# Altium schematic sheet 1_P1.schdoc
size 431 x 309 mm; Symbol: Sheet-Symbol_A3; Device: Sheet-Symbol_A3; @Page Name: P1; @Create Date: 2022-11-30; @Page Count: 1; @Page No: 1; @Project Name: DripBox; @Schematic Name: wifiPinBoard_1; @Update Date: 2023-02-20; Company: 深圳嘉立创科技发展有限公司; Drawed: 嘉立创EDA; Page Size: A3; Part Number: JLCPCB-001; Reviewed: 嘉立创EDA; Version: V0.1
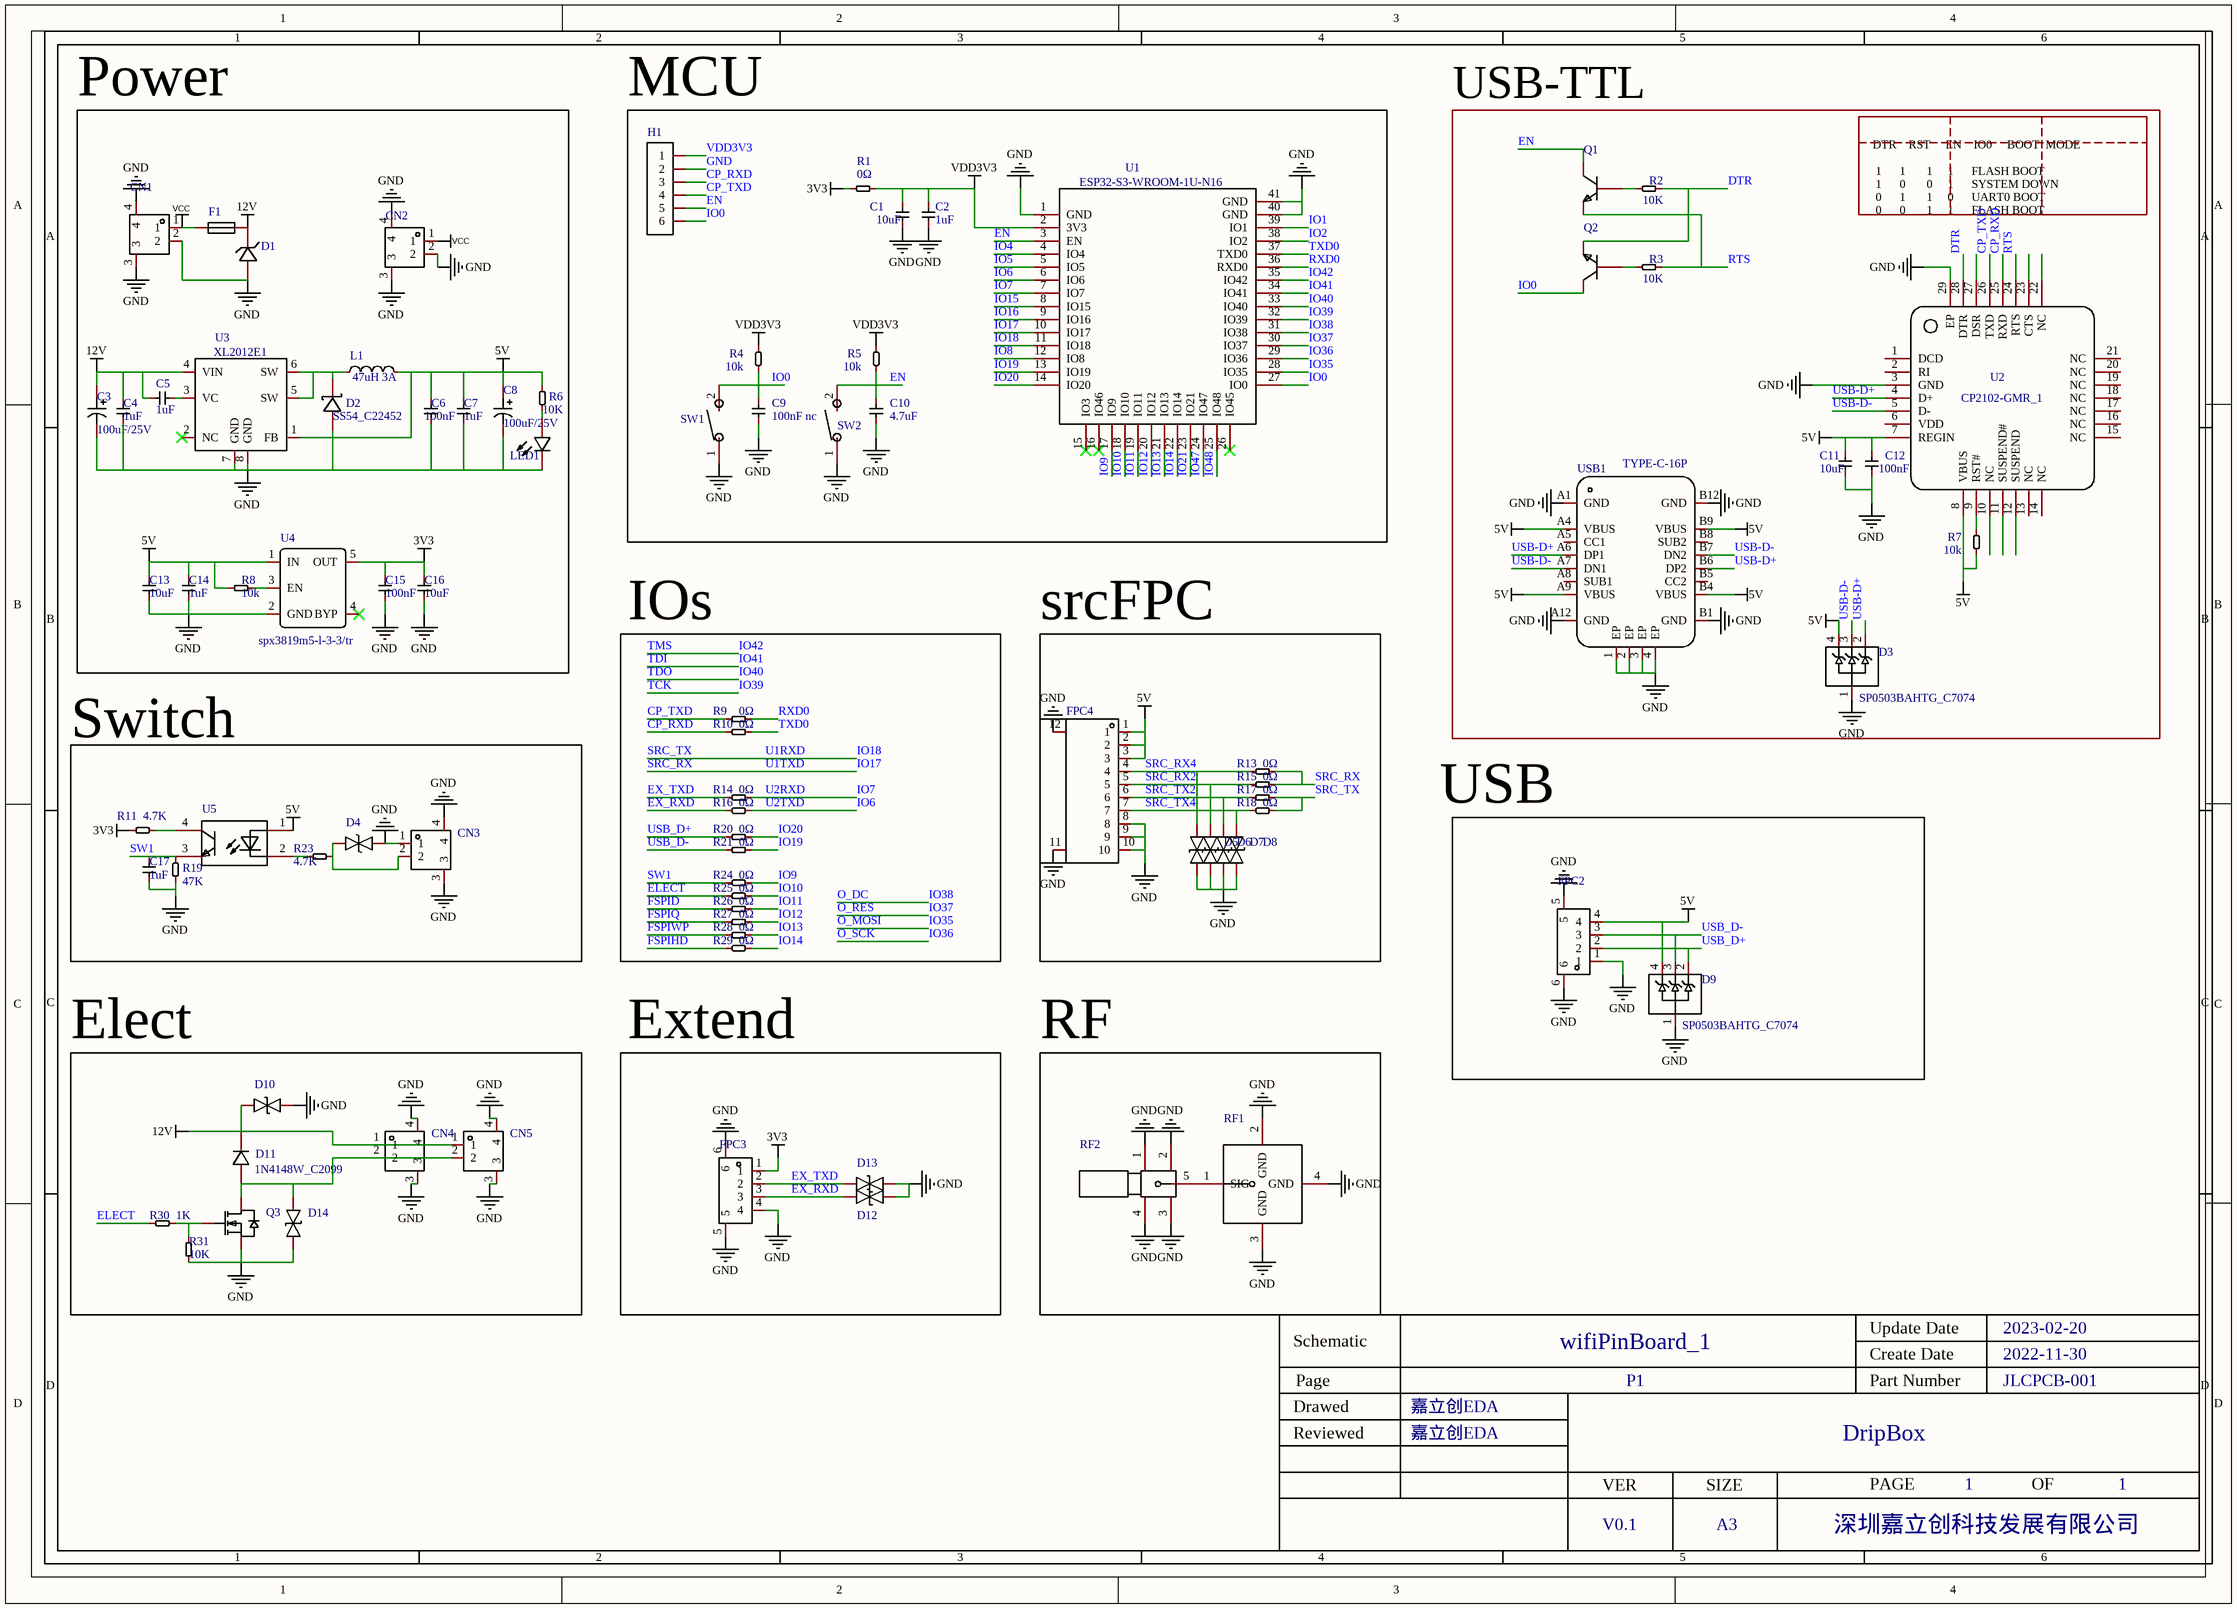
[diagram p0: 1_P1.schdoc]

## Parts
C1  value 10uF  [C0603]  (hidden comment: CAP-0603)
C2  value 1uF  [C0603]  (hidden comment: CAP-0603)
C3  value 100uF/25V  [CAP-SMD_BD6.3-L6.6-W6.6-LS7.6-FD]  (hidden comment: RVT47UF50V67RV0029)
C4  value 1uF  [C0603]  (hidden comment: CAP-0603)
C5  value 1uF  [C0603]  (hidden comment: CAP-0603)
C6  value 100nF  [C0603]  (hidden comment: CAP-0603)
C7  value 1uF  [C0603]  (hidden comment: CAP-0603)
C8  value 100uF/25V  [CAP-SMD_BD6.3-L6.6-W6.6-LS7.6-FD-1]  (hidden comment: RVE100UF35V67RV0072)
C9  value 100nF nc  [C0402]  (hidden comment: CAP-0402)
C10  value 4.7uF  [C0402]  (hidden comment: CAP-0402)
C11  value 10uF  [C0402]  (hidden comment: CAP-0402)
C12  value 100nF  [C0402]  (hidden comment: CAP-0402)
C13  value 10uF  [C0402]  (hidden comment: CAP-0402)
C14  value 1uF  [C0402]  (hidden comment: CAP-0402)
C15  value 100nF  [C0402]  (hidden comment: CAP-0402)
C16  value 10uF  [C0402]  (hidden comment: CAP-0402)
C17  value 1uF  [C0402]  (hidden comment: CAP-0402)
CN1  2.54-2A-LT  [CONN-SMD_2P-P2.54_XH2.54-2AB]  (value not drawn)
CN2  2.54-2A-LT  [CONN-SMD_2P-P2.54_XH2.54-2AB]  (value not drawn)
CN3  2.54-2A-LT  [CONN-SMD_2P-P2.54_XH2.54-2AB]  (value not drawn)
CN4  2.54-2A-LT  [CONN-SMD_2P-P2.54_XH2.54-2AB]  (value not drawn)
CN5  2.54-2A-LT  [CONN-SMD_2P-P2.54_XH2.54-2AB]  (value not drawn)
D1  SMBJ16A_C2848701  [SMB_L4.5-W3.7-LS5.4-RD]  (value not drawn)
D2  SS54_C22452  [SMA_L4.4-W2.8-LS5.4-R-RD]
D3  SP0503BAHTG_C7074  [SOT-143_L2.9-W1.3-P1.92-LS2.3-BR]
D4  SMF6.0CA  [SOD-123_L2.7-W1.8-LS3.7-BI]  (value not drawn)
D5  PESD3V3S1BA-N_C316037  [SOD-523_L1.2-W0.8-LS1.6-BI]  (value not drawn)
D6  PESD3V3S1BA-N_C316037  [SOD-523_L1.2-W0.8-LS1.6-BI]  (value not drawn)
D7  PESD3V3S1BA-N_C316037  [SOD-523_L1.2-W0.8-LS1.6-BI]  (value not drawn)
D8  PESD3V3S1BA-N_C316037  [SOD-523_L1.2-W0.8-LS1.6-BI]  (value not drawn)
D9  SP0503BAHTG_C7074  [SOT-143_L2.9-W1.3-P1.92-LS2.3-BR]
D10  SMF12CA  [SOD-123_L2.8-W1.8-LS3.7-BI]  (value not drawn)
D11  1N4148W  [SOD-123_L2.8-W1.8-LS3.7-RD]  (value not drawn)
D12  PESD3V3S1BA-N_C316037  [SOD-523_L1.2-W0.8-LS1.6-BI]  (value not drawn)
D13  PESD3V3S1BA-N_C316037  [SOD-523_L1.2-W0.8-LS1.6-BI]  (value not drawn)
D14  SMF12CA  [SOD-123_L2.8-W1.8-LS3.7-BI]  (value not drawn)
F1  BSMD1812-200-24V  [F1812]  (value not drawn)
FPC2  XH-4PS  [CONN-SMD_4P-P2.50_DEALON_XH-4PS]  (value not drawn)
FPC3  XH-4PS  [CONN-SMD_4P-P2.50_DEALON_XH-4PS]  (value not drawn)
FPC4  XF3M(1)-1015-1B  [FPC-SMD_10P-P1.00_XF3M1-1015-1B]  (value not drawn)
H1  2.54-1x6P直针  [HDR-TH_6P-P2.54-V-M-1]  (value not drawn)
L1  value 47uH 3A  [IND-SMD_L10.8-W10.0_SLO1040H]  (hidden comment: SLO1040H470MTT)
LED1  NCD0603R1_C84263  [LED0603-RD_RED]  (value not drawn)
Q1  MMST5551_C109331  [SOT-323-3_L2.0-W1.3-P1.30-LS2.1-BR]  (value not drawn)
Q2  MMST5551_C109331  [SOT-323-3_L2.0-W1.3-P1.30-LS2.1-BR]  (value not drawn)
Q3  AO3400A_C20917  [SOT-23-3_L2.9-W1.6-P1.90-LS2.8-BR]  (value not drawn)
R1  value 0Ω  [R0603]  (hidden comment: RES-0603)
R2  value 10K  [R0402_1]  (hidden comment: RES-0402)
R3  value 10K  [R0402_1]  (hidden comment: RES-0402)
R4  value 10k  [R0402_1]  (hidden comment: RES-0402)
R5  value 10k  [R0402_1]  (hidden comment: RES-0402)
R6  value 10K  [R0603]  (hidden comment: RES-0603)
R7  value 10k  [R0402_1]  (hidden comment: RES-0402)
R8  value 10k  [R0402_1]  (hidden comment: RES-0402)
R9  value 0Ω  [R0402_1]  (hidden comment: RES-0402)
R10  value 0Ω  [R0402_1]  (hidden comment: RES-0402)
R11  value 4.7K  [R0402_1]  (hidden comment: RES-0402)
R13  value 0Ω  [R0402_1]  (hidden comment: RES-0402)
R14  value 0Ω  [R0402_1]  (hidden comment: RES-0402)
R15  value 0Ω  [R0402_1]  (hidden comment: RES-0402)
R16  value 0Ω  [R0402_1]  (hidden comment: RES-0402)
R17  value 0Ω  [R0402_1]  (hidden comment: RES-0402)
R18  value 0Ω  [R0402_1]  (hidden comment: RES-0402)
R19  value 47K  [R0402_1]  (hidden comment: RES-0402)
R20  value 0Ω  [R0402_1]  (hidden comment: RES-0402)
R21  value 0Ω  [R0402_1]  (hidden comment: RES-0402)
R23  value 4.7K  [R0402_1]  (hidden comment: RES-0402)
R24  value 0Ω  [R0402_1]  (hidden comment: RES-0402)
R25  value 0Ω  [R0402_1]  (hidden comment: RES-0402)
R26  value 0Ω  [R0402_1]  (hidden comment: RES-0402)
R27  value 0Ω  [R0402_1]  (hidden comment: RES-0402)
R28  value 0Ω  [R0402_1]  (hidden comment: RES-0402)
R29  value 0Ω  [R0402_1]  (hidden comment: RES-0402)
R30  value 1K  [R0402_1]  (hidden comment: RES-0402)
R31  value 10K  [R0402_1]  (hidden comment: RES-0402)
RF1  KH-IPEX-K501-29  [ANT-SMD_KH-IPEX-K501-29]  (value not drawn)
RF2  KH-SMA-KE8-G  [CONN-SMD_KH-SMA-KE8-G]  (value not drawn)
SW1  3*4两脚按键不带柱  [SW-SMD_L4.0-W2.9-LS5.0]  (value not drawn)
SW2  3*4两脚按键不带柱  [SW-SMD_L4.0-W2.9-LS5.0]  (value not drawn)
U1  ESP32-S3-WROOM-1U-N16  [WIRELM-SMD_ESP32-S3-WROOM-1U]
U2  CP2102-GMR_1  [QFN-28_L5.0-W5.0-P0.50-BL-EP_1]
U3  XL2012E1  [SOIC-8_L5.0-W4.0-P1.27-LS6.0-BL]
U4  spx3819m5-l-3-3/tr  [SOT-23-5_L3.0-W1.7-P0.95-LS2.8-BR]
U5  EL3H7(B)(TA)-G  [SOP-4_L4.4-W2.8-P1.27-LS7.0-TL]  (value not drawn)
USB1  TYPE-C-16P  [USB-C-SMD_KH-TYPE-C-16P]

## Blocks framed on the sheet
Power: C3-C8 C13-C16 CN1 CN2 D1 D2 F1 L1 LED1 R6 R8 U3 U4
MCU: C1 C2 C9 C10 H1 R1 R4 R5 SW1 SW2 U1
USB-TTL: C11 C12 D3 Q1 Q2 R2 R3 R7 U2 USB1
IOs: R9 R10 R14 R16 R20 R21 R24-R29
srcFPC: D5-D8 FPC4 R13 R15 R17 R18
Switch: C17 CN3 D4 R11 R19 R23 U5
Elect: CN4 CN5 D10 D11 D14 Q3 R30 R31
Extend: D12 D13 FPC3
RF: RF1 RF2

## Nets
3V3: C15.1 C16.1 FPC3.1 R1.1 R11.1 U4.5(OUT)
5V: C6.1 C7.1 C8.1 C11.1 C12.1 C13.1 C14.1 D3.4 D9.4 FPC2.4 FPC4.1 FPC4.2 FPC4.3 L1.2 R6.1 R7.1 R8.2 U2.7(REGIN) U2.8(VBUS) U3.1(FB) U4.1(IN) U5.1(AN) USB1.A4(VBUS) USB1.A9(VBUS) USB1.B4(VBUS) USB1.B9(VBUS)
12V: C3.1 C4.1 C5.1 CN4.1 CN5.1 D1.1(C) D10.2(A) D11.1(K) F1.2 U3.4(VIN)
GND: C1.2 C2.2 C3.2 C4.2 C6.2 C7.2 C8.2 C9.2 C10.2 C11.2 C12.2 C13.2 C14.2 C15.2 C16.2 C17.2 CN1.2 CN1.3 CN1.4 CN2.2 CN2.3 CN2.4 CN3.1 CN3.3 CN3.4 CN4.3 CN4.4 CN5.3 CN5.4 D1.2(A) D2.1(A) D3.1 D4.1 D5.1 D6.1 D7.1 D8.1 D9.1 D10.1(K) D12.1 D13.1 D14.1(K) FPC2.1 FPC2.5 FPC2.6 FPC3.4 FPC3.5 FPC3.6 FPC4.8 FPC4.9 FPC4.10 FPC4.11 FPC4.12 H1.2 LED1.1(K) Q3.2(S) R19.2 R31.1 RF1.2(GND) RF1.3(GND) RF1.4(GND) RF2.1 RF2.2 RF2.3 RF2.4 SW1.1 SW2.1 U1.1(GND) U1.40(GND) U1.41(GND) U2.3(GND) U2.29(EP) U3.7(GND) U3.8(GND) U4.2(GND) USB1.1(EP) USB1.2(EP) USB1.3(EP) USB1.4(EP) USB1.A1(GND) USB1.A12(GND) USB1.B1(GND) USB1.B12(GND)
VCC: CN1.1 CN2.1 F1.1
VDD3V3: C1.1 C2.1 H1.1 R1.2 R4.2 R5.2 U1.2(3V3)
CP_RXD: H1.3 R10.1 U2.25(RXD)
CP_TXD: H1.4 R9.1 U2.26(TXD)
DTR: Q2.2(E) R2.2 U2.28(DTR)
ELECT: R25.1 R30.1
EN: C10.1 H1.5 Q1.3(C) R5.1 SW2.2 U1.3(EN)
EX_RXD: D12.2 FPC3.3 R16.1
EX_TXD: D13.2 FPC3.2 R14.1
FSPID: R26.1
FSPIHD: R29.1
FSPIQ: R27.1
FSPIWP: R28.1
IO0: C9.1 H1.6 Q2.3(C) R4.1 SW1.2 U1.27(IO0)
IO1: U1.39(IO1)
IO2: U1.38(IO2)
IO4: U1.4(IO4)
IO5: U1.5(IO5)
IO6: R16.2 U1.6(IO6)  [also labelled U2TXD]
IO7: R14.2 U1.7(IO7)  [also labelled U2RXD]
IO8: U1.12(IO8)
IO9: R24.2 U1.17(IO9)
IO10: R25.2 U1.18(IO10)
IO11: R26.2 U1.19(IO11)
IO12: R27.2 U1.20(IO12)
IO13: R28.2 U1.21(IO13)
IO14: R29.2 U1.22(IO14)
IO15: U1.8(IO15)
IO16: U1.9(IO16)
IO17: R13.2 R15.2 U1.10(IO17)  [also labelled SRC_RX, U1TXD]
IO18: R17.2 R18.2 U1.11(IO18)  [also labelled SRC_TX, U1RXD]
IO19: R21.2 U1.13(IO19)
IO20: R20.2 U1.14(IO20)
IO21: U1.23(IO21)
IO35: U1.28(IO35)  [also labelled O_MOSI]
IO36: U1.29(IO36)  [also labelled O_SCK]
IO37: U1.30(IO37)  [also labelled O_RES]
IO38: U1.31(IO38)  [also labelled O_DC]
IO39: U1.32(IO39)  [also labelled TCK]
IO40: U1.33(IO40)  [also labelled TDO]
IO41: U1.34(IO41)  [also labelled TDI]
IO42: U1.35(IO42)  [also labelled TMS]
IO47: U1.24(IO47)
IO48: U1.25(IO48)
RTS: Q1.2(E) R3.2 U2.24(RTS)
RXD0: R9.2 U1.36(RXD0)
SRC_RX2: D6.2 FPC4.5 R15.1
SRC_RX4: D5.2 FPC4.4 R13.1
SRC_TX2: D7.2 FPC4.6 R17.1
SRC_TX4: D8.2 FPC4.7 R18.1
SW1: C17.1 R19.1 R24.1 U5.3(EM)
TXD0: R10.2 U1.37(TXD0)
USB-D+: D3.2 U2.4(D+) USB1.A6(DP1) USB1.B6(DP2)
USB-D-: D3.3 U2.5(D-) USB1.A7(DN1) USB1.B7(DN2)
USB_D+: D9.2 FPC2.2 R20.1
USB_D-: D9.3 FPC2.3 R21.1
NetC5_2: C5.2 U3.3(VC)
NetCN3_2: CN3.2 D4.2 R23.1
NetCN4_2: CN4.2 CN5.2 D11.2(A) D14.2(A) Q3.3(D)
NetD2_2: D2.2(K) L1.1 U3.5(SW) U3.6(SW)
NetLED1_2: LED1.2(A) R6.2
NetQ1_1: Q1.1(B) R2.1
NetQ2_1: Q2.1(B) R3.1
NetQ3_1: Q3.1(G) R30.2 R31.2
NetR7_2: R7.2 U2.9(RST#)
NetR8_1: R8.1 U4.3(EN)
NetR11_2: R11.2 U5.4(COL)
NetR23_2: R23.2 U5.2(CAT)
NetRF1_1: RF1.1(SIG) RF2.5

Not connected (* = marked no-connect by the designer): U1 15(IO3)* 16(IO46)* 26(IO45)*; U2 1(DCD) 2(RI) 6(VDD) 10(NC) 11(SUSPEND#) 12(SUSPEND) 13(NC) 14(NC) 15(NC) 16(NC) 17(NC) 18(NC) 19(NC) 20(NC) 21(NC) 22(NC) 23(CTS) 27(DSR); U3 2(NC)*; U4 4(BYP)*; USB1 A5(CC1) A8(SUB1) B5(CC2) B8(SUB2)

## Notes on the sheet
- (near U2) DTR    RST     EN    IO0     BOOT  MODE
  1      1       1     1      FLASH BOOT
  1      0       0     1      SYSTEM DOWN
  0      1       1     0      UART0 BOOT
  0      0       1     1      FLASH BOOT
- USB
- 1
- 2
- 3
- 4
- 5
- 6
- A
- B
- C
- Schematic
- wifiPinBoard_1
- Create Date
- Update Date
- 2022-11-30
- 2023-02-20
- D
- Reviewed
- Drawed
- Page
- 嘉立创EDA
- P1
- Part Number
- DripBox
- JLCPCB-001
- VER
- SIZE
- PAGE
- OF
- V0.1
- A3
- 深圳嘉立创科技发展有限公司

## Library data of the parts
C1 C2 C4-C7 = CAP-0603: 容值:1uF;精度:±10%;额定电压:50V;温度系数:X5R;; Manufacturer: SAMSUNG(三星); Manufacturer Part: CL10A105KB8NNNC; Add into BOM: yes; Tolerance: ±10%; Voltage Rated: 50V; Temperature Coefficient: X5R; Symbol: CAP-0402; Device: CAP-0603; LCSC Part Name: 1uF ±10% 50V; Supplier Part: C15849; Supplier Footprint: 0603; JLCPCB Part Class: Basic Part; Datasheet: https://atta.szlcsc.com/upload/public/pdf/source/20160103/1457707679084.pdf; Supplier: LCSC; Convert to PCB: yes
C3 = RVT47UF50V67RV0029: 容值:47uF;额定电压:50V;工作寿命:2000hrs@105;; Manufacturer: KNSCHA(科尼盛); Add into BOM: yes; Rated Voltage: 50V; Name: 100uF/25V; Symbol: RVT47UF50V67RV0029; Device: RVT47UF50V67RV0029; LCSC Part Name: 47uF 50V; Supplier Part: C2887275; Manufacturer Part: RVT47UF50V67RV0029; Supplier Footprint: SMD,D6.3xL7.7mm; JLCPCB Part Class: 扩展库; Datasheet: https://atta.szlcsc.com/upload/public/pdf/source/20210824/3B61B08E802BEB202F31F6CC5BD6B8B5.pdf; Supplier: LCSC; Convert to PCB: yes; Lifetime @ Temp: 2000hrs@105
C8 = RVE100UF35V67RV0072: 容值:100uF;额定电压:35V;电容体直径:-;电容体长度:-;纹波电流:-;等效串联电阻:-;工作寿命:-;; Manufacturer: KNSCHA(科尼盛); Add into BOM: yes; Rated Voltage: 35V; Name: 100uF/25V; Symbol: RVE100UF35V67RV0072; Device: RVE100UF35V67RV0072; LCSC Part Name: 100uF 35V; Supplier Part: C2836437; Manufacturer Part: RVE100UF35V67RV0072; Supplier Footprint: SMD,D6.3xL7.7mm; JLCPCB Part Class: 扩展库; Datasheet: https://atta.szlcsc.com/upload/public/pdf/source/20220719/B52EB46F8A1558448ED03D8B4CB3C24F.pdf; Supplier: LCSC; Convert to PCB: yes; φD: -; L: -; Ripple Current: -; Equivalent Series Resistance(ESR): -; Lifetime @ Temp: -
C9-C17 = CAP-0402: 容值:1uF;精度:±10%;额定电压:10V;温度系数:X5R;; Manufacturer: SAMSUNG(三星); Manufacturer Part: CL05A105KP5NNND; Add into BOM: yes; Tolerance: ±10%; Voltage Rated: 10V; Temperature Coefficient: X5R; Symbol: CAP-0402; Device: CAP-0402; LCSC Part Name: 1uF ±10% 10V; Supplier Part: C307414; Supplier Footprint: 0402; JLCPCB Part Class: Extended Part; Datasheet: https://atta.szlcsc.com/upload/public/pdf/source/20181009/C307414_0A02B57115E94FED95F0CB1E32115BFC.pdf; Supplier: LCSC; Convert to PCB: yes
CN1-CN5 = 2.54-2A-LT: 参考系列:XH;间距:2.54mm;插针结构:1x2P;排数:1;每排PIN数:2;行距:-;公母:公型插针;安装方式:立贴;额定电流:500mA;工作温度范围:-25℃~+85℃;; Manufacturer: CAX(创都); Add into BOM: yes; Reference Series: XH; Pitch: 2.54mm; Pins Structure: 1x2P; Number of PINs Per Row: 2; Gender: 公型插针; Current Rating (Max): 500mA; Name: 2.54-2A-LT; Symbol: 2.54-2A-LT; Device: 2.54-2A-LT; LCSC Part Name: 2.54-2A-LT; Supplier Part: C722695; Manufacturer Part: 2.54-2A-LT; Supplier Footprint: SMD,P=2.54mm; JLCPCB Part Class: 扩展库; Datasheet: https://atta.szlcsc.com/upload/public/pdf/source/20200903/C722694_5A7103419A51CDA6451A9029F9B5B2B1.pdf; Supplier: LCSC; Convert to PCB: yes; Number of Rows: 1; Row Spacing: -; Mounting Style: 立贴; Operating Temperature Range: -25℃~+85℃
D1 = SMBJ16A_C2848701: 极性:单向;反向截止电压(Vrwm):16V;击穿电压(最小值):17.8V;击穿电压(最大值):20.5V;反向漏电流(Ir):5A;峰值脉冲电流(Ipp)@10/1000s:23.1A;最大钳位电压:26V;峰值脉冲功率(Ppp)@10/1000s:-;; Manufacturer: GOODWORK(固得沃克); Add into BOM: yes; Polarity: 单向; Reverse Stand-Off Voltage (Vrwm): 16V; Breakdown Voltage (Min): 17.8V; Breakdown Voltage (Max): 20.5V; Reverse Leakage Current (Ir): 5A; Peak Pulse Current (Ipp)@10/1000μs: 23.1A; Maximum Clamping Voltage: 26V; Name: SMBJ16A; Symbol: SMBJ16A_C2848701; Device: SMBJ16A_C2848701; LCSC Part Name: 单向 16V; Supplier Part: C2848701; Manufacturer Part: SMBJ16A; Supplier Footprint: SMB(DO-214AA); JLCPCB Part Class: 扩展库; Datasheet: https://atta.szlcsc.com/upload/public/pdf/source/20201231/C908783_5F0AE07776753216FC0A4122EEBBB8E2.pdf; Supplier: LCSC; Convert to PCB: yes; Peak Pulse Power Dissipation (Ppp)@10/1000μs: -
D2 = SS54_C22452: 直流反向耐压(Vr):40V;平均整流电流(Io):5A;正向压降(Vf):550mV@5A;; Manufacturer: MDD; Name: SS54; Add into BOM: yes; Reverse Voltage (Vr): 40V; Average Rectified Current (Io): 5A; Symbol: SS54_C22452; Device: SS54_C22452; LCSC Part Name: 40V 5A 550mV@5A; Supplier Part: C22452; Manufacturer Part: SS54; Supplier Footprint: SMA(DO-214AC); JLCPCB Part Class: 基础库; Datasheet: https://atta.szlcsc.com/upload/public/pdf/source/20190306/C22452_DC5E4F74C3B638F6D8E4C7650D5BF30E.pdf; Supplier: LCSC; Convert to PCB: yes; Forward Voltage (Vf@If): 550mV@5A
D3 D9 = SP0503BAHTG_C7074: Manufacturer: Littelfuse(美国力特); Add into BOM: yes; Name: SP0503BAHTG; Symbol: SP0503BAHTG; Device: SP0503BAHTG_C7074; LCSC Part Name: SP0503BAHTG; Supplier Part: C7074; Manufacturer Part: SP0503BAHTG; Supplier Footprint: SOT-143; JLCPCB Part Class: 扩展库; Datasheet: https://atta.szlcsc.com/upload/public/pdf/source/20160723/1469258976518.pdf; Supplier: LCSC; Convert to PCB: yes
D4 = SMF6.0CA_C435459: 极性:双向;反向截止电压(Vrwm):6V;击穿电压:6.67V;峰值脉冲电流(Ipp)@10/1000s:19.4A;最大钳位电压:10.3V;; Manufacturer: AnBon(安邦); Add into BOM: yes; Polarity: 双向; Reverse Stand-Off Voltage (Vrwm): 6V; Breakdown Voltage: 6.67V; Peak Pulse Current (Ipp)@10/1000μs: 19.4A; Maximum Clamping Voltage: 10.3V; Name: SMF6.0CA; Symbol: SMF6.0CA_C435459; Device: SMF6.0CA_C435459; LCSC Part Name: 双向 Vrwm:6V; Supplier Part: C435459; Manufacturer Part: SMF6.0CA; Supplier Footprint: SOD-123; JLCPCB Part Class: 扩展库; Datasheet: https://atta.szlcsc.com/upload/public/pdf/source/20191009/C435459_5796EF5BCA7523EFA6A562081B6F4DC8.pdf; Supplier: LCSC; Convert to PCB: yes
D5-D8 D12 D13 = PESD3V3S1BA-N_C316037: 极性:双向;反向截止电压(Vrwm):3.3V@Max;击穿电压(最小值):4V;峰值脉冲电流(Ipp)@10/1000s:10A@8/20s;最大钳位电压:10V;; Manufacturer: BORN(伯恩半导体); Add into BOM: yes; Polarity: 双向; Breakdown Voltage (Min): 4V; Maximum Clamping Voltage: 10V; Name: PESD3V3S1BA-N; Symbol: PESD3V3S1BA-N; Device: PESD3V3S1BA-N_C316037; LCSC Part Name: 双向 Vrwm:3.3V@Max; Supplier Part: C316037; Manufacturer Part: PESD3V3S1BA-N; Supplier Footprint: SOD-523; JLCPCB Part Class: 扩展库; Datasheet: https://atta.szlcsc.com/upload/public/pdf/source/20181025/C316037_BAF19C01D27FCD10CB9CD774B67153C5.pdf; Supplier: LCSC; Convert to PCB: yes; Reverse Stand-Off Voltage (Vrwm): 3.3V@Max; Peak Pulse Current (Ipp)@10/1000μs: 10A@8/20s
D10 D14 = SMF12CA_C284110: 极性:双向;反向截止电压(Vrwm):12V;击穿电压:13.3V;峰值脉冲电流(Ipp)@10/1000s:10.05A;最大钳位电压:19.9V;; Manufacturer: DOWO(东沃); Add into BOM: yes; Polarity: 双向; Reverse Stand-Off Voltage (Vrwm): 12V; Breakdown Voltage: 13.3V; Peak Pulse Current (Ipp)@10/1000μs: 10.05A; Maximum Clamping Voltage: 19.9V; Name: SMF12CA; Symbol: SMF12CA; Device: SMF12CA_C284110; LCSC Part Name: 双向 Vrwm:12V; Supplier Part: C284110; Manufacturer Part: SMF12CA; Supplier Footprint: SOD-123; JLCPCB Part Class: 扩展库; Datasheet: https://atta.szlcsc.com/upload/public/pdf/source/20180913/C284110_147BE089EFF8300E026DAF83CCD817E7.pdf; Supplier: LCSC; Convert to PCB: yes
D11 = 1N4148W_C2099: 二极管配置:独立式;功率:500mW;直流反向耐压(Vr):100V;平均整流电流(Io):150mA;正向压降(Vf):1.25V@150mA;反向电流(Ir):1uA@75V;反向恢复时间(trr):4ns;工作温度:+150℃@(Tj);; Manufacturer: CJ(江苏长电/长晶); Symbol: 1N4148W T4; Add into BOM: yes; Diode Configuration: 独立式; Power Dissipation: 500mW; Reverse Voltage (Vr): 100V; Average Rectified Current (Io): 150mA; Reverse Recovery Time (trr): 4ns; Name: 1N4148W; Device: 1N4148W_C2099; LCSC Part Name: 100V 150mA 4ns T4; Supplier Part: C2099; Manufacturer Part: 1N4148W; Supplier Footprint: SOD-123; JLCPCB Part Class: 扩展库; Datasheet: https://atta.szlcsc.com/upload/public/pdf/source/20120428/1457706480199.pdf; Supplier: LCSC; Convert to PCB: yes; Forward Voltage (Vf@If): 1.25V@150mA; Reverse Leakage Current: 1uA@75V; Operating Temperature: +150℃@(Tj)
F1 = BSMD1812-200-24V: 最大电压:24V;最大电流:40A;保持电流:2A;跳闸电流:4A;消耗功率:800mW;初始态阻值(最小值):20mΩ;跳断后阻值(最大值):100mΩ;最大动作时间:2s;工作温度:-40~+85;; Manufacturer: BHFUSE(佰宏); Add into BOM: yes; Operating Voltage (Max): 24V; Current Rating (Max): 40A; Hold Current: 2A; Trip Current: 4A; Power Dissipation: 800mW; Resistance - Initial (Ri) (Min): 20mΩ; Resistance - Post Trip (R1) (Max): 100mΩ; Maximum Time to Trip: 2s; Name: BSMD1812-200-24V; Symbol: BSMD1812-200-24V; Device: BSMD1812-200-24V; LCSC Part Name: 1812 2A 24V 佰宏高电压; Supplier Part: C883157; Manufacturer Part: BSMD1812-200-24V; Supplier Footprint: 1812; JLCPCB Part Class: 扩展库; Datasheet: https://atta.szlcsc.com/upload/public/pdf/source/20220302/C2BC3E2021B64191B0EAEFE91C1E6D76.pdf; Supplier: LCSC; Convert to PCB: yes; Operating Temperature: -40~+85
FPC2 FPC3 = XH-4PS: 参考系列:XH;间距:2.5mm;插针结构:1x4P;排数:1;每排PIN数:4;行距:-;公母:公型插针;安装方式:立贴;额定电流:3A;工作温度范围:-25℃~+85℃;; Manufacturer: DEALON(德艺隆); Add into BOM: yes; Reference Series: XH; Pitch: 2.5mm; Pins Structure: 1x4P; Number of PINs Per Row: 4; Gender: 公型插针; Current Rating (Max): 3A; Name: XH-4PS; Symbol: XH-4PS; Device: XH-4PS; LCSC Part Name: XH 2.5mm 1x4P 立贴; Supplier Part: C2904981; Manufacturer Part: XH-4PS; Supplier Footprint: SMD,P=2.5mm; JLCPCB Part Class: 扩展库; Datasheet: https://atta.szlcsc.com/upload/public/pdf/source/20211025/7FE20CBFE69B14B158D03C81143E3D85.pdf; Supplier: LCSC; Convert to PCB: yes; Number of Rows: 1; Row Spacing: -; Mounting Style: 立贴; Operating Temperature Range: -25℃~+85℃
FPC4 = XF3M(1)-1015-1B: 间距:1mm;触点数量:10;锁定特性:-;安装类型:卧贴;触点类型:双侧触点/上下接;; Manufacturer: OMRON(欧姆龙); Add into BOM: yes; Pitch: 1mm; Number of Contacts: 10; FFC, FCB Thickness: 0.3mm; Name: XF3M(1)-1015-1B; Symbol: XF3M(1)-1015-1B; Device: XF3M(1)-1015-1B; LCSC Part Name: 1mm P数:10 双侧触点/上下接; Supplier Part: C231427; Manufacturer Part: XF3M(1)-1015-1B; Supplier Footprint: SMD,P=1mm; JLCPCB Part Class: 扩展库; Datasheet: https://atta.szlcsc.com/upload/public/pdf/source/20180910/C231427_B13922BAFD8608886BCAD203DC0D40D0.pdf; Supplier: LCSC; Convert to PCB: yes; Locking Feature: -; Mounting Type: 卧贴; Contact Type: 双侧触点/上下接; Height Above Board: 2mm
H1 = 2.54-1x6P直针: 排数:单排;总PIN位数:6;间距:2.54mm;插针结构:1x6P;行距:-;安装类型:直插;圆针/方针:方针;额定电流:3A;额定电压:-;配合针长度:-;塑高:-;触头材质:黄铜;触头镀层:-;工作温度范围:-40℃~+105℃;颜色:黑色;; Manufacturer: BOOMELE(博穆精密); Symbol: Header-Male-2.54_1x6; Add into BOM: yes; Pitch: 2.54mm; Pin Structure: 1x6P; Circluar Pins/Square Pins: 方针; Current Rating (Max): 3A; Name: 2.54-1x6P直针; Device: 2.54-1x6P直针; LCSC Part Name: 2.54mm 1x6P 直插 方针; Supplier Part: C37208; Manufacturer Part: 2.54-1x6P直针; Supplier Footprint: 直插,P=2.54mm; JLCPCB Part Class: 扩展库; Datasheet: https://atta.szlcsc.com/upload/public/pdf/source/20151109/1457707558014.pdf; Supplier: LCSC; Convert to PCB: yes; Number of Rows: 单排; Number of Pins: 6; Row Spacing: -; Mounting Type: 直插; Voltage Rating (Max): -; Length of Mating Pin: -; Insulation Height: -; Contact Material: 黄铜; Contact Plating: -; Operating Temperature Range: -40℃~+105℃; Color: 黑色
L1 = SLO1040H470MTT: 电感值:47uH;精度:±20%;额定电流:3A;直流电阻(DCR):145mΩ;; Manufacturer: Sunltech(韩国顺磁); Add into BOM: yes; Tolerance: ±20%; Rated Current: 3A; DC Resistance (DCR): 145mΩ; Name: 47uH 3A; Symbol: SLO1040H470MTT; Device: SLO1040H470MTT; LCSC Part Name: 47uH ±20% 3A 145mΩ; Supplier Part: C182153; Manufacturer Part: SLO1040H470MTT; Supplier Footprint: SMD; JLCPCB Part Class: 扩展库; Datasheet: https://atta.szlcsc.com/upload/public/pdf/source/20201009/C207854_ACA4210DD273ACBB198904FC5A3A8806.pdf; Supplier: LCSC; Convert to PCB: yes
LED1 = NCD0603R1_C84263: 发光颜色:红灯;; Manufacturer: 国星光电; Symbol: FC-DA1608HRK-620D; Add into BOM: yes; Emitted Color: 红灯; Name: NCD0603R1; Device: NCD0603R1_C84263; LCSC Part Name: 红灯; Supplier Part: C84263; Manufacturer Part: NCD0603R1; Supplier Footprint: 0603; JLCPCB Part Class: 扩展库; Datasheet: https://atta.szlcsc.com/upload/public/pdf/source/20200820/C84263_DABC6A75E58F576973B407FDBA283D60.pdf; Supplier: LCSC; Convert to PCB: yes
Q1 Q2 = MMST5551_C109331: 晶体管类型:NPN;集射极击穿电压(Vceo):160V;集电极电流(Ic):600mA;功率(Pd):200mW;集电极截止电流(Icbo):50nA;集电极-发射极饱和电压(VCE(sat)@Ic,Ib):200mV@50mA,5mA;直流电流增益(hFE@Ic,Vce):100@10mA,5V;特征频率(fT):100MHz;工作温度:+150@(Tj);; Manufacturer: CJ(江苏长电/长晶); Add into BOM: yes; Transistor Type: NPN; Collector-Emitter Breakdown Voltage (Vceo): 160V; Collector Current (Ic): 600mA; Power Dissipation (Pd): 200mW; Collector Cut-Off Current (Icbo): 50nA; Transition Frequency (fT): 100MHz; Name: MMST5551; Symbol: MMST5551; Device: MMST5551_C109331; LCSC Part Name: MMST5551 100~300 100~300; Supplier Part: C109331; Manufacturer Part: MMST5551; Supplier Footprint: SOT-323(SC-70); JLCPCB Part Class: 扩展库; Datasheet: https://atta.szlcsc.com/upload/public/pdf/source/20170428/1493376776532.pdf; Supplier: LCSC; Convert to PCB: yes; Collector-Emitter Saturation Voltage (VCE(sat)@Ic,Ib): 200mV@50mA,5mA; DC Current Gain (hFE@Ic,Vce): 100@10mA,5V; Operating Temperature: +150@(Tj)
Q3 = AO3400A_C20917: 类型:N沟道;漏源电压(Vdss):30V;连续漏极电流(Id):5.7A;功率(Pd):1.4W;导通电阻(RDS(on)@Vgs,Id):26.5mΩ@10V,5.7A;阈值电压(Vgs(th)@Id):1.5V@250uA;; Manufacturer: AOS; Add into BOM: yes; Type: N沟道; Drain Source Voltage (Vdss): 30V; Power Dissipation (Pd): 1.4W; Name: AO3400A; Symbol: AO3400A; Device: AO3400A_C20917; LCSC Part Name: N沟道 30V 5.7A; Supplier Part: C20917; Manufacturer Part: AO3400A; Supplier Footprint: SOT-23-3L; JLCPCB Part Class: 基础库; Datasheet: https://atta.szlcsc.com/upload/public/pdf/source/20140107/1457706668533.pdf; Supplier: LCSC; Convert to PCB: yes; Continuous Drain Current (Id): 5.7A; Drain Source On Resistance (RDS(on)@Vgs,Id): 26.5mΩ@10V,5.7A; Gate Threshold Voltage (Vgs(th)@Id): 1.5V@250uA
R1 R6 = RES-0603: 电阻类型:厚膜电阻;阻值:1kΩ;精度:±1%;功率:1/10W;温度系数:±100ppm/;最大工作电压:75V;工作温度范围:-55~+155;; Manufacturer: UNI-ROYAL(厚声); Manufacturer Part: 0603WAF1001T5E; Add into BOM: yes; Tolerance: ±1%; Power(Watts): 1/10W; Overload Voltage (Max): 75V; Symbol: RES-0402; Device: RES-0603; LCSC Part Name: 1kΩ ±1%; Supplier Part: C21190; Supplier Footprint: 0603; JLCPCB Part Class: Basic Part; Datasheet: https://atta.szlcsc.com/upload/public/pdf/source/20200306/C422600_1E6D84923E4A46A82E41ADD87F860B5C.pdf; Supplier: LCSC; Convert to PCB: yes; Type: 厚膜电阻; Temperature Coefficient: ±100ppm/; Operating Temperature Range: -55~+155
R2-R5 R7 R8 R11 R19 R23 = RES-0402: 电阻类型:厚膜电阻;阻值:1k;精度:±1%;功率:1/16W;温度系数:±100ppm/;最大工作电压:50V;工作温度范围:-55~+155;; Manufacturer: UNI-ROYAL(厚声); Manufacturer Part: 0402WGF1001TCE; Add into BOM: yes; Tolerance: ±1%; Power(Watts): 1/16W; Overload Voltage (Max): 50V; Symbol: RES-0402; Device: RES-0402; LCSC Part Name: 1k ±1%; Supplier Part: C11702; Supplier Footprint: 0402; Datasheet: https://atta.szlcsc.com/upload/public/pdf/source/20200306/C422600_1E6D84923E4A46A82E41ADD87F860B5C.pdf; Supplier: LCSC; Convert to PCB: yes; Type: 厚膜电阻; Temperature Coefficient: ±100ppm/; Operating Temperature Range: -55~+155; JLCPCB Part Class: 基础库
R9 R10 R13-R18 R20 R21 R24-R31 = RES-0402: 电阻类型:厚膜电阻;阻值:1kΩ;精度:±1%;功率:1/16W;温度系数:±100ppm/;最大工作电压:50V;工作温度范围:-55~+155;; Manufacturer: UNI-ROYAL(厚声); Manufacturer Part: 0402WGF1001TCE; Add into BOM: yes; Tolerance: ±1%; Power(Watts): 1/16W; Overload Voltage (Max): 50V; Symbol: RES-0402; Device: RES-0402; LCSC Part Name: 1kΩ ±1%; Supplier Part: C11702; Supplier Footprint: 0402; Datasheet: https://atta.szlcsc.com/upload/public/pdf/source/20200306/C422600_1E6D84923E4A46A82E41ADD87F860B5C.pdf; Supplier: LCSC; Convert to PCB: yes; Type: 厚膜电阻; Temperature Coefficient: ±100ppm/; Operating Temperature Range: -55~+155; JLCPCB Part Class: 基础库
RF1 = KH-IPEX-K501-29: 连接器类型:板端;射频系列:IPEX;接口类型:内针;端口数量:1;阻抗:50Ω;频率-最大值:3GHz;样式:-;接口直径:2mm;接口长度/高度:1.25mm;工作温度范围:-40℃~+90℃;; Manufacturer: kinghelm(金航标); Add into BOM: yes; Connector Type: 板端; RF Series: IPEX; Interface Type: 内针; Number of Ports: 1; Impedance: 50Ω; Frequency-Max: 3GHz; Interface Diameter: 2mm; Interface Length/Height: 1.25mm; Name: KH-IPEX-K501-29; Symbol: KH-IPEX-K501-29; Device: KH-IPEX-K501-29; LCSC Part Name: IPEX 内针 1代; Supplier Part: C411563; Manufacturer Part: KH-IPEX-K501-29; Supplier Footprint: SMD; JLCPCB Part Class: 扩展库; Datasheet: https://atta.szlcsc.com/upload/public/pdf/source/20210317/C411563_B117163D510F1EF8C12FF082F555A034.pdf; Supplier: LCSC; Convert to PCB: yes; Style: -; Operating Temperature Range: -40℃~+90℃
RF2 = KH-SMA-KE8-G: 连接器类型:板端;射频系列:SMA;接口类型:内孔;端口数量:1;阻抗:-;频率-最大值:-;样式:偏脚;接口直径:-;接口长度/高度:8mm;工作温度范围:-;; Manufacturer: kinghelm(金航标); Add into BOM: yes; Connector Type: 板端; RF Series: SMA; Interface Type: 内孔; Number of Ports: 1; Sytle: 偏脚; Interface Length/Height: 8mm; Name: KH-SMA-KE8-G; Symbol: KH-SMA-KE8-G; Device: KH-SMA-KE8-G; LCSC Part Name: SMA镀金外螺内孔侧插半牙板端座子; Supplier Part: C530661; Manufacturer Part: KH-SMA-KE8-G; Supplier Footprint: 插件; JLCPCB Part Class: 扩展库; Datasheet: https://atta.szlcsc.com/upload/public/pdf/source/20200512/C530661_F969D51668E6BC228544FB5FCDBC3D39.pdf; Supplier: LCSC; Convert to PCB: yes; Impedance: -; Frequency-Max: -; Interface Diameter: -; Operating Temperature Range: -
SW1 SW2 = 3*4两脚按键不带柱: 触点电流:50mA;额定电压(DC):12V;绝缘电阻:100M;电路结构:单刀单掷;安装方式:立贴;按钮形状:圆形按钮;按钮/盖帽颜色:黑色;带灯:无;作用力:250gf@±50gf;机械寿命:50000;工作温度:-25~+70;引脚样式:SMD接片;开关长度:3.95mm;开关宽度:2.9mm;开关高度:2mm;带支架:否;; Manufacturer: BRIGHT(博瑞泰); Symbol: TSA343G00-250J2; Add into BOM: yes; Contact Current: 50mA; Voltage Rating (DC): 12V; Insulation Resistance: 100M; Circuit: 单刀单掷; Actuator Style: 圆形按钮; Actuator/Cap Color: 黑色; With Lamp: 无; Mechanical Life: 50000; Pin Style: SMD接片; Switch Length: 3.95mm; Switch Width: 2.9mm; Switch Height: 2mm; Strike Gundam: 否; Device: 3*4两脚按键不带柱; LCSC Part Name: 3*4 两脚小龟不带柱  250gf; Supplier Part: C354946; Manufacturer Part: TSA343G00-250J2; Supplier Footprint: SMD; Datasheet: https://atta.szlcsc.com/upload/public/pdf/source/20190426/C354946_6B70DFBDFA823D17B8EB46FB9599F693.pdf; Supplier: LCSC; Convert to PCB: yes; Mounting Style: 立贴; Operating Force: 250gf@±50gf; Operating Temperature: -25~+70; JLCPCB Part Class: Extended Part
U1 = ESP32-S3-WROOM-1U-N16: Manufacturer: ESPRESSIF(乐鑫); Add into BOM: yes; Name: ESP32-S3-WROOM-1U-N16; Symbol: ESP32-S3-WROOM-1U-N16; Device: ESP32-S3-WROOM-1U-N16; LCSC Part Name: ESP32-S3-WROOM-1U-N16; Supplier Part: C2980298; Manufacturer Part: ESP32-S3-WROOM-1U-N16; Supplier Footprint: SMD; JLCPCB Part Class: 扩展库; Datasheet: https://atta.szlcsc.com/upload/public/pdf/source/20220628/A2AC12B3C87735CAEB7EBE2DBE80936C.pdf; Supplier: LCSC; Convert to PCB: yes
U2 = CP2102-GMR_1: 类型:Transceiver;协议类别:USB;驱动器/接收器数:1/1;数据速率:1Mbps;; Manufacturer: SILICON LABS(芯科); Add into BOM: yes; Protocol: USB; Number of Drivers/Receivers: 1/1; Data Rate: 1Mbps; Supply Voltage: 3V ~ 3.6V; Symbol: CP2102-GMR_1; Device: CP2102-GMR_1; LCSC Part Name: CP2102-GMR; Supplier Part: C6568; Manufacturer Part: CP2102-GMR; Supplier Footprint: QFN-28_5x5x05P; Datasheet: https://atta.szlcsc.com/upload/public/pdf/source/20170103/1483439882795.pdf; Supplier: LCSC; Convert to PCB: yes; Type: Transceiver; JLCPCB Part Class: Basic Part
U3 = XL2012E1: 功能类型:降压型;同步整流:否;输出通道数:1;拓扑结构:降压式;输入电压:8V~40V;输出电压:5V;输出电流(最大值):2.4A;开关频率:150kHz;; Manufacturer: XLSEMI(芯龙); Add into BOM: yes; Function: 降压型; Synchronous Rectification: 否; Number of Outputs: 1; Topology: 降压式; Input Voltage: 8V~40V; Output Voltage: 5V; Output Current (Max): 2.4A; Switching Frequency: 150kHz; Name: XL2012E1; Symbol: XL2012E1; Device: XL2012E1; LCSC Part Name: 降压型 8V~40V 2.4A 150kHz; Supplier Part: C73338; Manufacturer Part: XL2012E1; Supplier Footprint: SOIC-8_150mil; JLCPCB Part Class: 扩展库; Datasheet: https://atta.szlcsc.com/upload/public/pdf/source/20160514/1463194849923.pdf; Supplier: LCSC; Convert to PCB: yes
U4 = spx3819m5-l-3-3/tr: 输出类型:固定;输出极性:正;输出通道数:1;最大输入电压:16V;输出电压:3.3V;压差:700mV@(500mA);输出电流:500mA;电源纹波抑制比(PRSS):70dB;; Manufacturer: MaxLinear; Add into BOM: yes; Output Type: 固定; Output Polarity: 正; Number of Outputs: 1; Maximum Input Voltage: 16V; Output Voltage: 3.3V; Power Supply Rejection Ratio (PRSS): 70dB; Symbol: SPX3819M5-L-3-3/TR; Device: spx3819m5-l-3-3/tr; LCSC Part Name: Vin=16V Vout=3.3V 500mA 70dB; Supplier Part: C9055; Manufacturer Part: SPX3819M5-L-3-3/TR; Supplier Footprint: SOT-23-5; JLCPCB Part Class: Extended Part; Datasheet: https://atta.szlcsc.com/upload/public/pdf/source/20160421/1461205045150.pdf; Supplier: LCSC; Convert to PCB: yes; Dropout Voltage: 700mV@(500mA); Output Current: 500mA
U5 = EL3H7(B)(TA)-G: 输入电压类型:DC;输出类型:光电三极管;输出通道数:1;正向压降:1.2V;反向电压:6V;输出电流:50mA;接收端电压:80V;集射极饱和电压(Vce(sat)@Ic,IF):100mV@1mA,10mA;上升时间:5us@2mA,100Ω;下降时间:3us@2mA,100Ω;隔离电压(rms):3.75kV;工作温度:-55℃~+110℃;; Manufacturer: EVERLIGHT(亿光); Add into BOM: yes; Input voltage type: DC; Output Type: 光电三极管; Number of Outputs: 1; Forward Voltage: 1.2V; Reverse Voltage: 6V; Output Current: 50mA; Receiving End Voltage: 80V; Isolation Voltage(rms): 3.75kV; Name: EL3H7(B)(TA)-G; Symbol: EL3H7(B)(TA)-G; Device: EL3H7(B)(TA)-G; LCSC Part Name: EL3H7(B)(TA)-G; Supplier Part: C32565; Manufacturer Part: EL3H7(B)(TA)-G; Supplier Footprint: SOP-4-2.8mm; JLCPCB Part Class: 基础库; Datasheet: https://atta.szlcsc.com/upload/public/pdf/source/20140621/1457707095564.pdf; Supplier: LCSC; Convert to PCB: yes; Collector-Emitter Saturation Voltage (Vce(sat)@Ic,IF): 100mV@1mA,10mA; Rise time: 5us@2mA,100Ω; Fall time: 3us@2mA,100Ω; Operating Temperature: -55℃~+110℃
USB1 = TYPE-C-16P: 连接器类型:Type-C;标准:-;公母:母座;触点数量:16;端口数量:1;安装方式:卧贴;额定电流 - 电源:3A;工作温度范围:-40~+85;; Manufacturer: kinghelm(金航标); Symbol: KH-TYPE-C-16P; Add into BOM: yes; Connector Type: Type-C; Gender: 母座; Number of Contacts: 16; Number of Ports: 1; Current Rating - Power (Max): 3A; Device: TYPE-C-16P; LCSC Part Name: Type-C 母座 卧贴; Supplier Part: C709357; Manufacturer Part: KH-TYPE-C-16P; Supplier Footprint: SMD; Datasheet: https://atta.szlcsc.com/upload/public/pdf/source/20200911/C709357_AA8DCEB38BB20E3035A7ED7AE7667837.pdf; Supplier: LCSC; Convert to PCB: yes; Standard: -; Mounting Style: 卧贴; Operating Temperature Range: -40~+85; JLCPCB Part Class: Extended Part